# Altium project Service_board.PrjPcb (part 5 of 9)
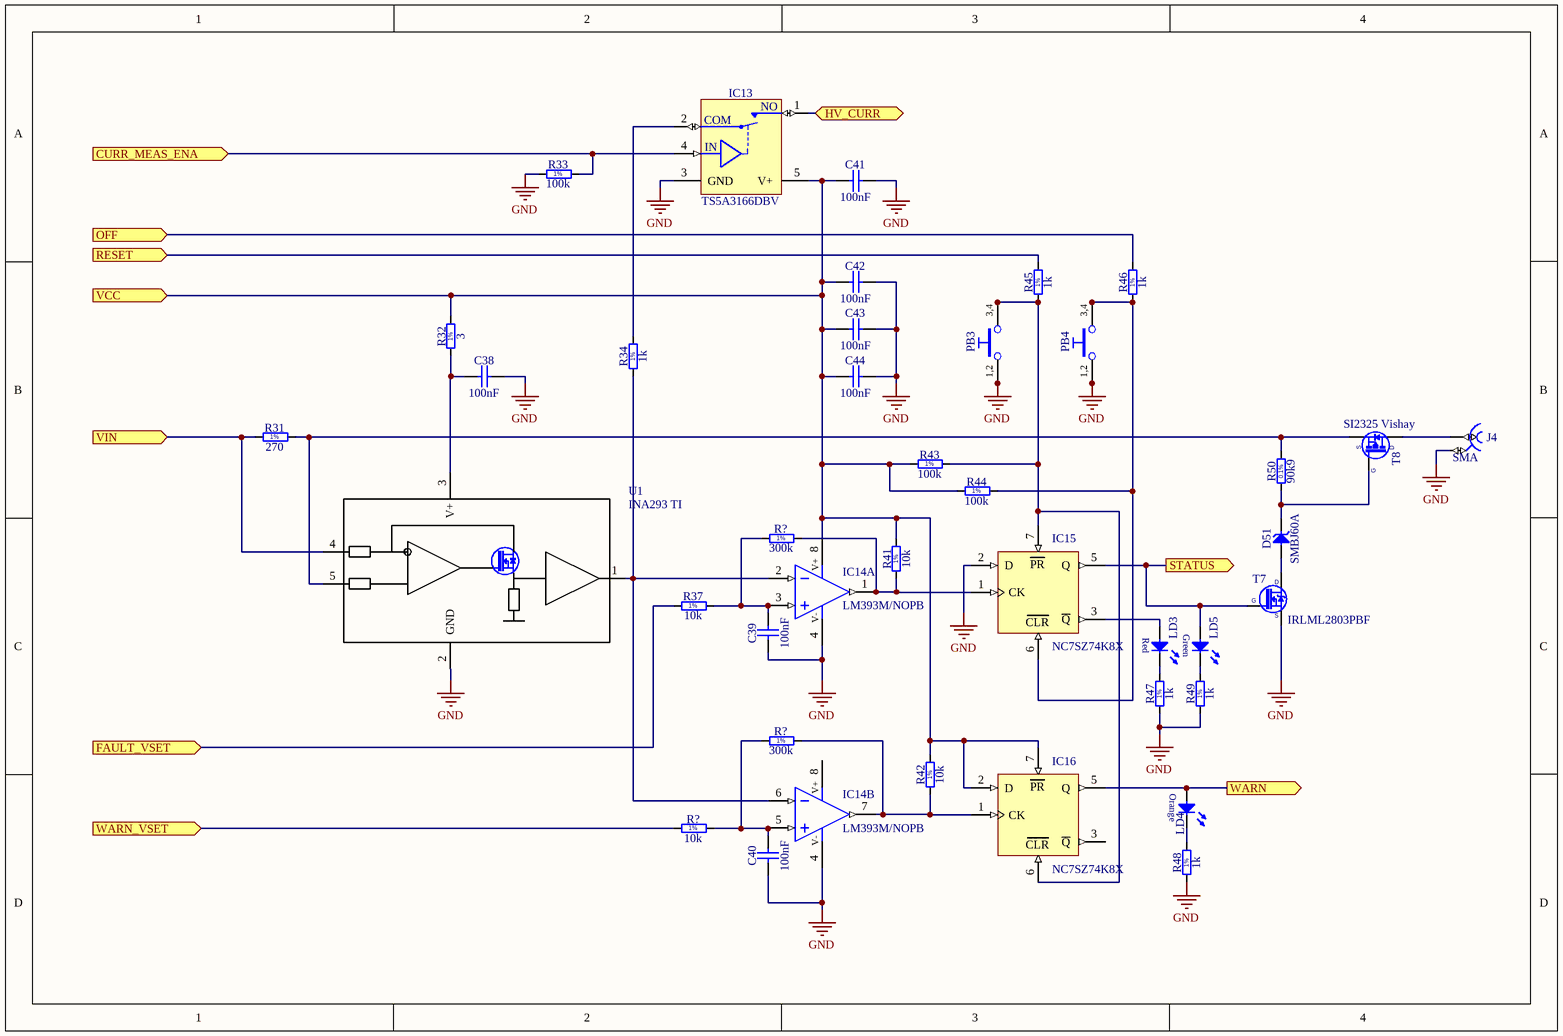
[diagram p11: Switch.SchDoc]

## Sheet Switch.SchDoc (continued)

### Channels (continued)
U_Bank/U_Channel/U_Switch: designators C38=C38_U_Bank_U_Channel_U_Switch#28 C39=C39_U_Bank_U_Channel_U_Switch#28 C40=C40_U_Bank_U_Channel_U_Switch#28 C41=C41_U_Bank_U_Channel_U_Switch#28 C42=C42_U_Bank_U_Channel_U_Switch#28 C43=C43_U_Bank_U_Channel_U_Switch#28 C44=C44_U_Bank_U_Channel_U_Switch#28 D51=D51_U_Bank_U_Channel_U_Switch#28 IC13=IC13_U_Bank_U_Channel_U_Switch#28 IC14=IC14_U_Bank_U_Channel_U_Switch#28 IC15=IC15_U_Bank_U_Channel_U_Switch#28 IC16=IC16_U_Bank_U_Channel_U_Switch#28 J4=J4_U_Bank_U_Channel_U_Switch#28 LD3=LD3_U_Bank_U_Channel_U_Switch#28 LD4=LD4_U_Bank_U_Channel_U_Switch#28 LD5=LD5_U_Bank_U_Channel_U_Switch#28 PB3=PB3_U_Bank_U_Channel_U_Switch#28 PB4=PB4_U_Bank_U_Channel_U_Switch#28 R31=R31_U_Bank_U_Channel_U_Switch#28 R32=R32_U_Bank_U_Channel_U_Switch#28 R33=R33_U_Bank_U_Channel_U_Switch#28 R34=R34_U_Bank_U_Channel_U_Switch#28 R37=R37_U_Bank_U_Channel_U_Switch#28 R41=R41_U_Bank_U_Channel_U_Switch#28 R42=R42_U_Bank_U_Channel_U_Switch#28 R43=R43_U_Bank_U_Channel_U_Switch#28 R44=R44_U_Bank_U_Channel_U_Switch#28 R45=R45_U_Bank_U_Channel_U_Switch#28 R46=R46_U_Bank_U_Channel_U_Switch#28 R47=R47_U_Bank_U_Channel_U_Switch#28 R48=R48_U_Bank_U_Channel_U_Switch#28 R49=R49_U_Bank_U_Channel_U_Switch#28 R50=R50_U_Bank_U_Channel_U_Switch#28 R?=R?_U_Bank_U_Channel_U_Switch#84 R?=R?_U_Bank_U_Channel_U_Switch#83 R?=R?_U_Bank_U_Channel_U_Switch#82 T7=T7_U_Bank_U_Channel_U_Switch#28 T8=T8_U_Bank_U_Channel_U_Switch#28 U1=U1_U_Bank_U_Channel_U_Switch#28; ports CURR_MEAS_ENA=NetIC2_U_Bank_U_Channel#14_7 FAULT_VSET=NetR37_U_Bank_U_Channel_U_Switch#1_1 HV_CURR=NetIC8_23 OFF=NetIC2_U_Bank_U_Channel#14_3 RESET=NetIC2_U_Bank_U_Channel#14_5 STATUS=NetIC2_U_Bank_U_Channel#14_11 VCC=NetC41_U_Bank_U_Channel_U_Switch#1_1 VIN=NetC?#3_2 WARN=W_B1 WARN_VSET=NetR?_U_Bank_U_Channel_U_Switch#3_1
U_Bank/U_Channel/U_Switch: designators C38=C38_U_Bank_U_Channel_U_Switch#29 C39=C39_U_Bank_U_Channel_U_Switch#29 C40=C40_U_Bank_U_Channel_U_Switch#29 C41=C41_U_Bank_U_Channel_U_Switch#29 C42=C42_U_Bank_U_Channel_U_Switch#29 C43=C43_U_Bank_U_Channel_U_Switch#29 C44=C44_U_Bank_U_Channel_U_Switch#29 D51=D51_U_Bank_U_Channel_U_Switch#29 IC13=IC13_U_Bank_U_Channel_U_Switch#29 IC14=IC14_U_Bank_U_Channel_U_Switch#29 IC15=IC15_U_Bank_U_Channel_U_Switch#29 IC16=IC16_U_Bank_U_Channel_U_Switch#29 J4=J4_U_Bank_U_Channel_U_Switch#29 LD3=LD3_U_Bank_U_Channel_U_Switch#29 LD4=LD4_U_Bank_U_Channel_U_Switch#29 LD5=LD5_U_Bank_U_Channel_U_Switch#29 PB3=PB3_U_Bank_U_Channel_U_Switch#29 PB4=PB4_U_Bank_U_Channel_U_Switch#29 R31=R31_U_Bank_U_Channel_U_Switch#29 R32=R32_U_Bank_U_Channel_U_Switch#29 R33=R33_U_Bank_U_Channel_U_Switch#29 R34=R34_U_Bank_U_Channel_U_Switch#29 R37=R37_U_Bank_U_Channel_U_Switch#29 R41=R41_U_Bank_U_Channel_U_Switch#29 R42=R42_U_Bank_U_Channel_U_Switch#29 R43=R43_U_Bank_U_Channel_U_Switch#29 R44=R44_U_Bank_U_Channel_U_Switch#29 R45=R45_U_Bank_U_Channel_U_Switch#29 R46=R46_U_Bank_U_Channel_U_Switch#29 R47=R47_U_Bank_U_Channel_U_Switch#29 R48=R48_U_Bank_U_Channel_U_Switch#29 R49=R49_U_Bank_U_Channel_U_Switch#29 R50=R50_U_Bank_U_Channel_U_Switch#29 R?=R?_U_Bank_U_Channel_U_Switch#87 R?=R?_U_Bank_U_Channel_U_Switch#86 R?=R?_U_Bank_U_Channel_U_Switch#85 T7=T7_U_Bank_U_Channel_U_Switch#29 T8=T8_U_Bank_U_Channel_U_Switch#29 U1=U1_U_Bank_U_Channel_U_Switch#29; ports CURR_MEAS_ENA=NetIC2_U_Bank_U_Channel#15_14 FAULT_VSET=NetR37_U_Bank_U_Channel_U_Switch#1_1 HV_CURR=NetIC8_23 OFF=NetIC2_U_Bank_U_Channel#15_18 RESET=NetIC2_U_Bank_U_Channel#15_16 STATUS=NetIC2_U_Bank_U_Channel#15_8 VCC=NetC41_U_Bank_U_Channel_U_Switch#1_1 VIN=NetC?#3_2 WARN=W_A2 WARN_VSET=NetR?_U_Bank_U_Channel_U_Switch#3_1
U_Bank/U_Channel/U_Switch: designators C38=C38_U_Bank_U_Channel_U_Switch#30 C39=C39_U_Bank_U_Channel_U_Switch#30 C40=C40_U_Bank_U_Channel_U_Switch#30 C41=C41_U_Bank_U_Channel_U_Switch#30 C42=C42_U_Bank_U_Channel_U_Switch#30 C43=C43_U_Bank_U_Channel_U_Switch#30 C44=C44_U_Bank_U_Channel_U_Switch#30 D51=D51_U_Bank_U_Channel_U_Switch#30 IC13=IC13_U_Bank_U_Channel_U_Switch#30 IC14=IC14_U_Bank_U_Channel_U_Switch#30 IC15=IC15_U_Bank_U_Channel_U_Switch#30 IC16=IC16_U_Bank_U_Channel_U_Switch#30 J4=J4_U_Bank_U_Channel_U_Switch#30 LD3=LD3_U_Bank_U_Channel_U_Switch#30 LD4=LD4_U_Bank_U_Channel_U_Switch#30 LD5=LD5_U_Bank_U_Channel_U_Switch#30 PB3=PB3_U_Bank_U_Channel_U_Switch#30 PB4=PB4_U_Bank_U_Channel_U_Switch#30 R31=R31_U_Bank_U_Channel_U_Switch#30 R32=R32_U_Bank_U_Channel_U_Switch#30 R33=R33_U_Bank_U_Channel_U_Switch#30 R34=R34_U_Bank_U_Channel_U_Switch#30 R37=R37_U_Bank_U_Channel_U_Switch#30 R41=R41_U_Bank_U_Channel_U_Switch#30 R42=R42_U_Bank_U_Channel_U_Switch#30 R43=R43_U_Bank_U_Channel_U_Switch#30 R44=R44_U_Bank_U_Channel_U_Switch#30 R45=R45_U_Bank_U_Channel_U_Switch#30 R46=R46_U_Bank_U_Channel_U_Switch#30 R47=R47_U_Bank_U_Channel_U_Switch#30 R48=R48_U_Bank_U_Channel_U_Switch#30 R49=R49_U_Bank_U_Channel_U_Switch#30 R50=R50_U_Bank_U_Channel_U_Switch#30 R?=R?_U_Bank_U_Channel_U_Switch#90 R?=R?_U_Bank_U_Channel_U_Switch#89 R?=R?_U_Bank_U_Channel_U_Switch#88 T7=T7_U_Bank_U_Channel_U_Switch#30 T8=T8_U_Bank_U_Channel_U_Switch#30 U1=U1_U_Bank_U_Channel_U_Switch#30; ports CURR_MEAS_ENA=NetIC2_U_Bank_U_Channel#15_7 FAULT_VSET=NetR37_U_Bank_U_Channel_U_Switch#1_1 HV_CURR=NetIC8_23 OFF=NetIC2_U_Bank_U_Channel#15_3 RESET=NetIC2_U_Bank_U_Channel#15_5 STATUS=NetIC2_U_Bank_U_Channel#15_11 VCC=NetC41_U_Bank_U_Channel_U_Switch#1_1 VIN=NetC?#3_2 WARN=W_B2 WARN_VSET=NetR?_U_Bank_U_Channel_U_Switch#3_1
U_Bank/U_Channel/U_Switch: designators C38=C38_U_Bank_U_Channel_U_Switch#31 C39=C39_U_Bank_U_Channel_U_Switch#31 C40=C40_U_Bank_U_Channel_U_Switch#31 C41=C41_U_Bank_U_Channel_U_Switch#31 C42=C42_U_Bank_U_Channel_U_Switch#31 C43=C43_U_Bank_U_Channel_U_Switch#31 C44=C44_U_Bank_U_Channel_U_Switch#31 D51=D51_U_Bank_U_Channel_U_Switch#31 IC13=IC13_U_Bank_U_Channel_U_Switch#31 IC14=IC14_U_Bank_U_Channel_U_Switch#31 IC15=IC15_U_Bank_U_Channel_U_Switch#31 IC16=IC16_U_Bank_U_Channel_U_Switch#31 J4=J4_U_Bank_U_Channel_U_Switch#31 LD3=LD3_U_Bank_U_Channel_U_Switch#31 LD4=LD4_U_Bank_U_Channel_U_Switch#31 LD5=LD5_U_Bank_U_Channel_U_Switch#31 PB3=PB3_U_Bank_U_Channel_U_Switch#31 PB4=PB4_U_Bank_U_Channel_U_Switch#31 R31=R31_U_Bank_U_Channel_U_Switch#31 R32=R32_U_Bank_U_Channel_U_Switch#31 R33=R33_U_Bank_U_Channel_U_Switch#31 R34=R34_U_Bank_U_Channel_U_Switch#31 R37=R37_U_Bank_U_Channel_U_Switch#31 R41=R41_U_Bank_U_Channel_U_Switch#31 R42=R42_U_Bank_U_Channel_U_Switch#31 R43=R43_U_Bank_U_Channel_U_Switch#31 R44=R44_U_Bank_U_Channel_U_Switch#31 R45=R45_U_Bank_U_Channel_U_Switch#31 R46=R46_U_Bank_U_Channel_U_Switch#31 R47=R47_U_Bank_U_Channel_U_Switch#31 R48=R48_U_Bank_U_Channel_U_Switch#31 R49=R49_U_Bank_U_Channel_U_Switch#31 R50=R50_U_Bank_U_Channel_U_Switch#31 R?=R?_U_Bank_U_Channel_U_Switch#93 R?=R?_U_Bank_U_Channel_U_Switch#92 R?=R?_U_Bank_U_Channel_U_Switch#91 T7=T7_U_Bank_U_Channel_U_Switch#31 T8=T8_U_Bank_U_Channel_U_Switch#31 U1=U1_U_Bank_U_Channel_U_Switch#31; ports CURR_MEAS_ENA=NetIC2_U_Bank_U_Channel#16_14 FAULT_VSET=NetR37_U_Bank_U_Channel_U_Switch#1_1 HV_CURR=NetIC8_23 OFF=NetIC2_U_Bank_U_Channel#16_18 RESET=NetIC2_U_Bank_U_Channel#16_16 STATUS=NetIC2_U_Bank_U_Channel#16_8 VCC=NetC41_U_Bank_U_Channel_U_Switch#1_1 VIN=NetC?#3_2 WARN=W_A3 WARN_VSET=NetR?_U_Bank_U_Channel_U_Switch#3_1
U_Bank/U_Channel/U_Switch: designators C38=C38_U_Bank_U_Channel_U_Switch#32 C39=C39_U_Bank_U_Channel_U_Switch#32 C40=C40_U_Bank_U_Channel_U_Switch#32 C41=C41_U_Bank_U_Channel_U_Switch#32 C42=C42_U_Bank_U_Channel_U_Switch#32 C43=C43_U_Bank_U_Channel_U_Switch#32 C44=C44_U_Bank_U_Channel_U_Switch#32 D51=D51_U_Bank_U_Channel_U_Switch#32 IC13=IC13_U_Bank_U_Channel_U_Switch#32 IC14=IC14_U_Bank_U_Channel_U_Switch#32 IC15=IC15_U_Bank_U_Channel_U_Switch#32 IC16=IC16_U_Bank_U_Channel_U_Switch#32 J4=J4_U_Bank_U_Channel_U_Switch#32 LD3=LD3_U_Bank_U_Channel_U_Switch#32 LD4=LD4_U_Bank_U_Channel_U_Switch#32 LD5=LD5_U_Bank_U_Channel_U_Switch#32 PB3=PB3_U_Bank_U_Channel_U_Switch#32 PB4=PB4_U_Bank_U_Channel_U_Switch#32 R31=R31_U_Bank_U_Channel_U_Switch#32 R32=R32_U_Bank_U_Channel_U_Switch#32 R33=R33_U_Bank_U_Channel_U_Switch#32 R34=R34_U_Bank_U_Channel_U_Switch#32 R37=R37_U_Bank_U_Channel_U_Switch#32 R41=R41_U_Bank_U_Channel_U_Switch#32 R42=R42_U_Bank_U_Channel_U_Switch#32 R43=R43_U_Bank_U_Channel_U_Switch#32 R44=R44_U_Bank_U_Channel_U_Switch#32 R45=R45_U_Bank_U_Channel_U_Switch#32 R46=R46_U_Bank_U_Channel_U_Switch#32 R47=R47_U_Bank_U_Channel_U_Switch#32 R48=R48_U_Bank_U_Channel_U_Switch#32 R49=R49_U_Bank_U_Channel_U_Switch#32 R50=R50_U_Bank_U_Channel_U_Switch#32 R?=R?_U_Bank_U_Channel_U_Switch#96 R?=R?_U_Bank_U_Channel_U_Switch#95 R?=R?_U_Bank_U_Channel_U_Switch#94 T7=T7_U_Bank_U_Channel_U_Switch#32 T8=T8_U_Bank_U_Channel_U_Switch#32 U1=U1_U_Bank_U_Channel_U_Switch#32; ports CURR_MEAS_ENA=NetIC2_U_Bank_U_Channel#16_7 FAULT_VSET=NetR37_U_Bank_U_Channel_U_Switch#1_1 HV_CURR=NetIC8_23 OFF=NetIC2_U_Bank_U_Channel#16_3 RESET=NetIC2_U_Bank_U_Channel#16_5 STATUS=NetIC2_U_Bank_U_Channel#16_11 VCC=NetC41_U_Bank_U_Channel_U_Switch#1_1 VIN=NetC?#3_2 WARN=W_B3 WARN_VSET=NetR?_U_Bank_U_Channel_U_Switch#3_1
U_Bank/U_Channel/U_Switch: designators C38=C38_U_Bank_U_Channel_U_Switch#33 C39=C39_U_Bank_U_Channel_U_Switch#33 C40=C40_U_Bank_U_Channel_U_Switch#33 C41=C41_U_Bank_U_Channel_U_Switch#33 C42=C42_U_Bank_U_Channel_U_Switch#33 C43=C43_U_Bank_U_Channel_U_Switch#33 C44=C44_U_Bank_U_Channel_U_Switch#33 D51=D51_U_Bank_U_Channel_U_Switch#33 IC13=IC13_U_Bank_U_Channel_U_Switch#33 IC14=IC14_U_Bank_U_Channel_U_Switch#33 IC15=IC15_U_Bank_U_Channel_U_Switch#33 IC16=IC16_U_Bank_U_Channel_U_Switch#33 J4=J4_U_Bank_U_Channel_U_Switch#33 LD3=LD3_U_Bank_U_Channel_U_Switch#33 LD4=LD4_U_Bank_U_Channel_U_Switch#33 LD5=LD5_U_Bank_U_Channel_U_Switch#33 PB3=PB3_U_Bank_U_Channel_U_Switch#33 PB4=PB4_U_Bank_U_Channel_U_Switch#33 R31=R31_U_Bank_U_Channel_U_Switch#33 R32=R32_U_Bank_U_Channel_U_Switch#33 R33=R33_U_Bank_U_Channel_U_Switch#33 R34=R34_U_Bank_U_Channel_U_Switch#33 R37=R37_U_Bank_U_Channel_U_Switch#33 R41=R41_U_Bank_U_Channel_U_Switch#33 R42=R42_U_Bank_U_Channel_U_Switch#33 R43=R43_U_Bank_U_Channel_U_Switch#33 R44=R44_U_Bank_U_Channel_U_Switch#33 R45=R45_U_Bank_U_Channel_U_Switch#33 R46=R46_U_Bank_U_Channel_U_Switch#33 R47=R47_U_Bank_U_Channel_U_Switch#33 R48=R48_U_Bank_U_Channel_U_Switch#33 R49=R49_U_Bank_U_Channel_U_Switch#33 R50=R50_U_Bank_U_Channel_U_Switch#33 R?=R?_U_Bank_U_Channel_U_Switch#99 R?=R?_U_Bank_U_Channel_U_Switch#98 R?=R?_U_Bank_U_Channel_U_Switch#97 T7=T7_U_Bank_U_Channel_U_Switch#33 T8=T8_U_Bank_U_Channel_U_Switch#33 U1=U1_U_Bank_U_Channel_U_Switch#33; ports CURR_MEAS_ENA=NetIC2_U_Bank_U_Channel#17_14 FAULT_VSET=NetR37_U_Bank_U_Channel_U_Switch#1_1 HV_CURR=NetIC8_23 OFF=NetIC2_U_Bank_U_Channel#17_18 RESET=NetIC2_U_Bank_U_Channel#17_16 STATUS=NetIC2_U_Bank_U_Channel#17_8 VCC=NetC41_U_Bank_U_Channel_U_Switch#1_1 VIN=NetC?#3_2 WARN=W_A0 WARN_VSET=NetR?_U_Bank_U_Channel_U_Switch#3_1
U_Bank/U_Channel/U_Switch: designators C38=C38_U_Bank_U_Channel_U_Switch#34 C39=C39_U_Bank_U_Channel_U_Switch#34 C40=C40_U_Bank_U_Channel_U_Switch#34 C41=C41_U_Bank_U_Channel_U_Switch#34 C42=C42_U_Bank_U_Channel_U_Switch#34 C43=C43_U_Bank_U_Channel_U_Switch#34 C44=C44_U_Bank_U_Channel_U_Switch#34 D51=D51_U_Bank_U_Channel_U_Switch#34 IC13=IC13_U_Bank_U_Channel_U_Switch#34 IC14=IC14_U_Bank_U_Channel_U_Switch#34 IC15=IC15_U_Bank_U_Channel_U_Switch#34 IC16=IC16_U_Bank_U_Channel_U_Switch#34 J4=J4_U_Bank_U_Channel_U_Switch#34 LD3=LD3_U_Bank_U_Channel_U_Switch#34 LD4=LD4_U_Bank_U_Channel_U_Switch#34 LD5=LD5_U_Bank_U_Channel_U_Switch#34 PB3=PB3_U_Bank_U_Channel_U_Switch#34 PB4=PB4_U_Bank_U_Channel_U_Switch#34 R31=R31_U_Bank_U_Channel_U_Switch#34 R32=R32_U_Bank_U_Channel_U_Switch#34 R33=R33_U_Bank_U_Channel_U_Switch#34 R34=R34_U_Bank_U_Channel_U_Switch#34 R37=R37_U_Bank_U_Channel_U_Switch#34 R41=R41_U_Bank_U_Channel_U_Switch#34 R42=R42_U_Bank_U_Channel_U_Switch#34 R43=R43_U_Bank_U_Channel_U_Switch#34 R44=R44_U_Bank_U_Channel_U_Switch#34 R45=R45_U_Bank_U_Channel_U_Switch#34 R46=R46_U_Bank_U_Channel_U_Switch#34 R47=R47_U_Bank_U_Channel_U_Switch#34 R48=R48_U_Bank_U_Channel_U_Switch#34 R49=R49_U_Bank_U_Channel_U_Switch#34 R50=R50_U_Bank_U_Channel_U_Switch#34 R?=R?_U_Bank_U_Channel_U_Switch#102 R?=R?_U_Bank_U_Channel_U_Switch#101 R?=R?_U_Bank_U_Channel_U_Switch#100 T7=T7_U_Bank_U_Channel_U_Switch#34 T8=T8_U_Bank_U_Channel_U_Switch#34 U1=U1_U_Bank_U_Channel_U_Switch#34; ports CURR_MEAS_ENA=NetIC2_U_Bank_U_Channel#17_7 FAULT_VSET=NetR37_U_Bank_U_Channel_U_Switch#1_1 HV_CURR=NetIC8_23 OFF=NetIC2_U_Bank_U_Channel#17_3 RESET=NetIC2_U_Bank_U_Channel#17_5 STATUS=NetIC2_U_Bank_U_Channel#17_11 VCC=NetC41_U_Bank_U_Channel_U_Switch#1_1 VIN=NetC?#3_2 WARN=W_B0 WARN_VSET=NetR?_U_Bank_U_Channel_U_Switch#3_1
U_Bank/U_Channel/U_Switch: designators C38=C38_U_Bank_U_Channel_U_Switch#35 C39=C39_U_Bank_U_Channel_U_Switch#35 C40=C40_U_Bank_U_Channel_U_Switch#35 C41=C41_U_Bank_U_Channel_U_Switch#35 C42=C42_U_Bank_U_Channel_U_Switch#35 C43=C43_U_Bank_U_Channel_U_Switch#35 C44=C44_U_Bank_U_Channel_U_Switch#35 D51=D51_U_Bank_U_Channel_U_Switch#35 IC13=IC13_U_Bank_U_Channel_U_Switch#35 IC14=IC14_U_Bank_U_Channel_U_Switch#35 IC15=IC15_U_Bank_U_Channel_U_Switch#35 IC16=IC16_U_Bank_U_Channel_U_Switch#35 J4=J4_U_Bank_U_Channel_U_Switch#35 LD3=LD3_U_Bank_U_Channel_U_Switch#35 LD4=LD4_U_Bank_U_Channel_U_Switch#35 LD5=LD5_U_Bank_U_Channel_U_Switch#35 PB3=PB3_U_Bank_U_Channel_U_Switch#35 PB4=PB4_U_Bank_U_Channel_U_Switch#35 R31=R31_U_Bank_U_Channel_U_Switch#35 R32=R32_U_Bank_U_Channel_U_Switch#35 R33=R33_U_Bank_U_Channel_U_Switch#35 R34=R34_U_Bank_U_Channel_U_Switch#35 R37=R37_U_Bank_U_Channel_U_Switch#35 R41=R41_U_Bank_U_Channel_U_Switch#35 R42=R42_U_Bank_U_Channel_U_Switch#35 R43=R43_U_Bank_U_Channel_U_Switch#35 R44=R44_U_Bank_U_Channel_U_Switch#35 R45=R45_U_Bank_U_Channel_U_Switch#35 R46=R46_U_Bank_U_Channel_U_Switch#35 R47=R47_U_Bank_U_Channel_U_Switch#35 R48=R48_U_Bank_U_Channel_U_Switch#35 R49=R49_U_Bank_U_Channel_U_Switch#35 R50=R50_U_Bank_U_Channel_U_Switch#35 R?=R?_U_Bank_U_Channel_U_Switch#105 R?=R?_U_Bank_U_Channel_U_Switch#104 R?=R?_U_Bank_U_Channel_U_Switch#103 T7=T7_U_Bank_U_Channel_U_Switch#35 T8=T8_U_Bank_U_Channel_U_Switch#35 U1=U1_U_Bank_U_Channel_U_Switch#35; ports CURR_MEAS_ENA=NetIC2_U_Bank_U_Channel#18_14 FAULT_VSET=NetR37_U_Bank_U_Channel_U_Switch#1_1 HV_CURR=NetIC8_23 OFF=NetIC2_U_Bank_U_Channel#18_18 RESET=NetIC2_U_Bank_U_Channel#18_16 STATUS=NetIC2_U_Bank_U_Channel#18_8 VCC=NetC41_U_Bank_U_Channel_U_Switch#1_1 VIN=NetC?#3_2 WARN=W_A1 WARN_VSET=NetR?_U_Bank_U_Channel_U_Switch#3_1
U_Bank/U_Channel/U_Switch: designators C38=C38_U_Bank_U_Channel_U_Switch#36 C39=C39_U_Bank_U_Channel_U_Switch#36 C40=C40_U_Bank_U_Channel_U_Switch#36 C41=C41_U_Bank_U_Channel_U_Switch#36 C42=C42_U_Bank_U_Channel_U_Switch#36 C43=C43_U_Bank_U_Channel_U_Switch#36 C44=C44_U_Bank_U_Channel_U_Switch#36 D51=D51_U_Bank_U_Channel_U_Switch#36 IC13=IC13_U_Bank_U_Channel_U_Switch#36 IC14=IC14_U_Bank_U_Channel_U_Switch#36 IC15=IC15_U_Bank_U_Channel_U_Switch#36 IC16=IC16_U_Bank_U_Channel_U_Switch#36 J4=J4_U_Bank_U_Channel_U_Switch#36 LD3=LD3_U_Bank_U_Channel_U_Switch#36 LD4=LD4_U_Bank_U_Channel_U_Switch#36 LD5=LD5_U_Bank_U_Channel_U_Switch#36 PB3=PB3_U_Bank_U_Channel_U_Switch#36 PB4=PB4_U_Bank_U_Channel_U_Switch#36 R31=R31_U_Bank_U_Channel_U_Switch#36 R32=R32_U_Bank_U_Channel_U_Switch#36 R33=R33_U_Bank_U_Channel_U_Switch#36 R34=R34_U_Bank_U_Channel_U_Switch#36 R37=R37_U_Bank_U_Channel_U_Switch#36 R41=R41_U_Bank_U_Channel_U_Switch#36 R42=R42_U_Bank_U_Channel_U_Switch#36 R43=R43_U_Bank_U_Channel_U_Switch#36 R44=R44_U_Bank_U_Channel_U_Switch#36 R45=R45_U_Bank_U_Channel_U_Switch#36 R46=R46_U_Bank_U_Channel_U_Switch#36 R47=R47_U_Bank_U_Channel_U_Switch#36 R48=R48_U_Bank_U_Channel_U_Switch#36 R49=R49_U_Bank_U_Channel_U_Switch#36 R50=R50_U_Bank_U_Channel_U_Switch#36 R?=R?_U_Bank_U_Channel_U_Switch#108 R?=R?_U_Bank_U_Channel_U_Switch#107 R?=R?_U_Bank_U_Channel_U_Switch#106 T7=T7_U_Bank_U_Channel_U_Switch#36 T8=T8_U_Bank_U_Channel_U_Switch#36 U1=U1_U_Bank_U_Channel_U_Switch#36; ports CURR_MEAS_ENA=NetIC2_U_Bank_U_Channel#18_7 FAULT_VSET=NetR37_U_Bank_U_Channel_U_Switch#1_1 HV_CURR=NetIC8_23 OFF=NetIC2_U_Bank_U_Channel#18_3 RESET=NetIC2_U_Bank_U_Channel#18_5 STATUS=NetIC2_U_Bank_U_Channel#18_11 VCC=NetC41_U_Bank_U_Channel_U_Switch#1_1 VIN=NetC?#3_2 WARN=W_B1 WARN_VSET=NetR?_U_Bank_U_Channel_U_Switch#3_1
U_Bank/U_Channel/U_Switch: designators C38=C38_U_Bank_U_Channel_U_Switch#37 C39=C39_U_Bank_U_Channel_U_Switch#37 C40=C40_U_Bank_U_Channel_U_Switch#37 C41=C41_U_Bank_U_Channel_U_Switch#37 C42=C42_U_Bank_U_Channel_U_Switch#37 C43=C43_U_Bank_U_Channel_U_Switch#37 C44=C44_U_Bank_U_Channel_U_Switch#37 D51=D51_U_Bank_U_Channel_U_Switch#37 IC13=IC13_U_Bank_U_Channel_U_Switch#37 IC14=IC14_U_Bank_U_Channel_U_Switch#37 IC15=IC15_U_Bank_U_Channel_U_Switch#37 IC16=IC16_U_Bank_U_Channel_U_Switch#37 J4=J4_U_Bank_U_Channel_U_Switch#37 LD3=LD3_U_Bank_U_Channel_U_Switch#37 LD4=LD4_U_Bank_U_Channel_U_Switch#37 LD5=LD5_U_Bank_U_Channel_U_Switch#37 PB3=PB3_U_Bank_U_Channel_U_Switch#37 PB4=PB4_U_Bank_U_Channel_U_Switch#37 R31=R31_U_Bank_U_Channel_U_Switch#37 R32=R32_U_Bank_U_Channel_U_Switch#37 R33=R33_U_Bank_U_Channel_U_Switch#37 R34=R34_U_Bank_U_Channel_U_Switch#37 R37=R37_U_Bank_U_Channel_U_Switch#37 R41=R41_U_Bank_U_Channel_U_Switch#37 R42=R42_U_Bank_U_Channel_U_Switch#37 R43=R43_U_Bank_U_Channel_U_Switch#37 R44=R44_U_Bank_U_Channel_U_Switch#37 R45=R45_U_Bank_U_Channel_U_Switch#37 R46=R46_U_Bank_U_Channel_U_Switch#37 R47=R47_U_Bank_U_Channel_U_Switch#37 R48=R48_U_Bank_U_Channel_U_Switch#37 R49=R49_U_Bank_U_Channel_U_Switch#37 R50=R50_U_Bank_U_Channel_U_Switch#37 R?=R?_U_Bank_U_Channel_U_Switch#111 R?=R?_U_Bank_U_Channel_U_Switch#110 R?=R?_U_Bank_U_Channel_U_Switch#109 T7=T7_U_Bank_U_Channel_U_Switch#37 T8=T8_U_Bank_U_Channel_U_Switch#37 U1=U1_U_Bank_U_Channel_U_Switch#37; ports CURR_MEAS_ENA=NetIC2_U_Bank_U_Channel#19_14 FAULT_VSET=NetR37_U_Bank_U_Channel_U_Switch#1_1 HV_CURR=NetIC8_23 OFF=NetIC2_U_Bank_U_Channel#19_18 RESET=NetIC2_U_Bank_U_Channel#19_16 STATUS=NetIC2_U_Bank_U_Channel#19_8 VCC=NetC41_U_Bank_U_Channel_U_Switch#1_1 VIN=NetC?#3_2 WARN=W_A2 WARN_VSET=NetR?_U_Bank_U_Channel_U_Switch#3_1
U_Bank/U_Channel/U_Switch: designators C38=C38_U_Bank_U_Channel_U_Switch#38 C39=C39_U_Bank_U_Channel_U_Switch#38 C40=C40_U_Bank_U_Channel_U_Switch#38 C41=C41_U_Bank_U_Channel_U_Switch#38 C42=C42_U_Bank_U_Channel_U_Switch#38 C43=C43_U_Bank_U_Channel_U_Switch#38 C44=C44_U_Bank_U_Channel_U_Switch#38 D51=D51_U_Bank_U_Channel_U_Switch#38 IC13=IC13_U_Bank_U_Channel_U_Switch#38 IC14=IC14_U_Bank_U_Channel_U_Switch#38 IC15=IC15_U_Bank_U_Channel_U_Switch#38 IC16=IC16_U_Bank_U_Channel_U_Switch#38 J4=J4_U_Bank_U_Channel_U_Switch#38 LD3=LD3_U_Bank_U_Channel_U_Switch#38 LD4=LD4_U_Bank_U_Channel_U_Switch#38 LD5=LD5_U_Bank_U_Channel_U_Switch#38 PB3=PB3_U_Bank_U_Channel_U_Switch#38 PB4=PB4_U_Bank_U_Channel_U_Switch#38 R31=R31_U_Bank_U_Channel_U_Switch#38 R32=R32_U_Bank_U_Channel_U_Switch#38 R33=R33_U_Bank_U_Channel_U_Switch#38 R34=R34_U_Bank_U_Channel_U_Switch#38 R37=R37_U_Bank_U_Channel_U_Switch#38 R41=R41_U_Bank_U_Channel_U_Switch#38 R42=R42_U_Bank_U_Channel_U_Switch#38 R43=R43_U_Bank_U_Channel_U_Switch#38 R44=R44_U_Bank_U_Channel_U_Switch#38 R45=R45_U_Bank_U_Channel_U_Switch#38 R46=R46_U_Bank_U_Channel_U_Switch#38 R47=R47_U_Bank_U_Channel_U_Switch#38 R48=R48_U_Bank_U_Channel_U_Switch#38 R49=R49_U_Bank_U_Channel_U_Switch#38 R50=R50_U_Bank_U_Channel_U_Switch#38 R?=R?_U_Bank_U_Channel_U_Switch#114 R?=R?_U_Bank_U_Channel_U_Switch#113 R?=R?_U_Bank_U_Channel_U_Switch#112 T7=T7_U_Bank_U_Channel_U_Switch#38 T8=T8_U_Bank_U_Channel_U_Switch#38 U1=U1_U_Bank_U_Channel_U_Switch#38; ports CURR_MEAS_ENA=NetIC2_U_Bank_U_Channel#19_7 FAULT_VSET=NetR37_U_Bank_U_Channel_U_Switch#1_1 HV_CURR=NetIC8_23 OFF=NetIC2_U_Bank_U_Channel#19_3 RESET=NetIC2_U_Bank_U_Channel#19_5 STATUS=NetIC2_U_Bank_U_Channel#19_11 VCC=NetC41_U_Bank_U_Channel_U_Switch#1_1 VIN=NetC?#3_2 WARN=W_B2 WARN_VSET=NetR?_U_Bank_U_Channel_U_Switch#3_1
U_Bank/U_Channel/U_Switch: designators C38=C38_U_Bank_U_Channel_U_Switch#39 C39=C39_U_Bank_U_Channel_U_Switch#39 C40=C40_U_Bank_U_Channel_U_Switch#39 C41=C41_U_Bank_U_Channel_U_Switch#39 C42=C42_U_Bank_U_Channel_U_Switch#39 C43=C43_U_Bank_U_Channel_U_Switch#39 C44=C44_U_Bank_U_Channel_U_Switch#39 D51=D51_U_Bank_U_Channel_U_Switch#39 IC13=IC13_U_Bank_U_Channel_U_Switch#39 IC14=IC14_U_Bank_U_Channel_U_Switch#39 IC15=IC15_U_Bank_U_Channel_U_Switch#39 IC16=IC16_U_Bank_U_Channel_U_Switch#39 J4=J4_U_Bank_U_Channel_U_Switch#39 LD3=LD3_U_Bank_U_Channel_U_Switch#39 LD4=LD4_U_Bank_U_Channel_U_Switch#39 LD5=LD5_U_Bank_U_Channel_U_Switch#39 PB3=PB3_U_Bank_U_Channel_U_Switch#39 PB4=PB4_U_Bank_U_Channel_U_Switch#39 R31=R31_U_Bank_U_Channel_U_Switch#39 R32=R32_U_Bank_U_Channel_U_Switch#39 R33=R33_U_Bank_U_Channel_U_Switch#39 R34=R34_U_Bank_U_Channel_U_Switch#39 R37=R37_U_Bank_U_Channel_U_Switch#39 R41=R41_U_Bank_U_Channel_U_Switch#39 R42=R42_U_Bank_U_Channel_U_Switch#39 R43=R43_U_Bank_U_Channel_U_Switch#39 R44=R44_U_Bank_U_Channel_U_Switch#39 R45=R45_U_Bank_U_Channel_U_Switch#39 R46=R46_U_Bank_U_Channel_U_Switch#39 R47=R47_U_Bank_U_Channel_U_Switch#39 R48=R48_U_Bank_U_Channel_U_Switch#39 R49=R49_U_Bank_U_Channel_U_Switch#39 R50=R50_U_Bank_U_Channel_U_Switch#39 R?=R?_U_Bank_U_Channel_U_Switch#117 R?=R?_U_Bank_U_Channel_U_Switch#116 R?=R?_U_Bank_U_Channel_U_Switch#115 T7=T7_U_Bank_U_Channel_U_Switch#39 T8=T8_U_Bank_U_Channel_U_Switch#39 U1=U1_U_Bank_U_Channel_U_Switch#39; ports CURR_MEAS_ENA=NetIC2_U_Bank_U_Channel#20_14 FAULT_VSET=NetR37_U_Bank_U_Channel_U_Switch#1_1 HV_CURR=NetIC8_23 OFF=NetIC2_U_Bank_U_Channel#20_18 RESET=NetIC2_U_Bank_U_Channel#20_16 STATUS=NetIC2_U_Bank_U_Channel#20_8 VCC=NetC41_U_Bank_U_Channel_U_Switch#1_1 VIN=NetC?#3_2 WARN=W_A3 WARN_VSET=NetR?_U_Bank_U_Channel_U_Switch#3_1
U_Bank/U_Channel/U_Switch: designators C38=C38_U_Bank_U_Channel_U_Switch#40 C39=C39_U_Bank_U_Channel_U_Switch#40 C40=C40_U_Bank_U_Channel_U_Switch#40 C41=C41_U_Bank_U_Channel_U_Switch#40 C42=C42_U_Bank_U_Channel_U_Switch#40 C43=C43_U_Bank_U_Channel_U_Switch#40 C44=C44_U_Bank_U_Channel_U_Switch#40 D51=D51_U_Bank_U_Channel_U_Switch#40 IC13=IC13_U_Bank_U_Channel_U_Switch#40 IC14=IC14_U_Bank_U_Channel_U_Switch#40 IC15=IC15_U_Bank_U_Channel_U_Switch#40 IC16=IC16_U_Bank_U_Channel_U_Switch#40 J4=J4_U_Bank_U_Channel_U_Switch#40 LD3=LD3_U_Bank_U_Channel_U_Switch#40 LD4=LD4_U_Bank_U_Channel_U_Switch#40 LD5=LD5_U_Bank_U_Channel_U_Switch#40 PB3=PB3_U_Bank_U_Channel_U_Switch#40 PB4=PB4_U_Bank_U_Channel_U_Switch#40 R31=R31_U_Bank_U_Channel_U_Switch#40 R32=R32_U_Bank_U_Channel_U_Switch#40 R33=R33_U_Bank_U_Channel_U_Switch#40 R34=R34_U_Bank_U_Channel_U_Switch#40 R37=R37_U_Bank_U_Channel_U_Switch#40 R41=R41_U_Bank_U_Channel_U_Switch#40 R42=R42_U_Bank_U_Channel_U_Switch#40 R43=R43_U_Bank_U_Channel_U_Switch#40 R44=R44_U_Bank_U_Channel_U_Switch#40 R45=R45_U_Bank_U_Channel_U_Switch#40 R46=R46_U_Bank_U_Channel_U_Switch#40 R47=R47_U_Bank_U_Channel_U_Switch#40 R48=R48_U_Bank_U_Channel_U_Switch#40 R49=R49_U_Bank_U_Channel_U_Switch#40 R50=R50_U_Bank_U_Channel_U_Switch#40 R?=R?_U_Bank_U_Channel_U_Switch#120 R?=R?_U_Bank_U_Channel_U_Switch#119 R?=R?_U_Bank_U_Channel_U_Switch#118 T7=T7_U_Bank_U_Channel_U_Switch#40 T8=T8_U_Bank_U_Channel_U_Switch#40 U1=U1_U_Bank_U_Channel_U_Switch#40; ports CURR_MEAS_ENA=NetIC2_U_Bank_U_Channel#20_7 FAULT_VSET=NetR37_U_Bank_U_Channel_U_Switch#1_1 HV_CURR=NetIC8_23 OFF=NetIC2_U_Bank_U_Channel#20_3 RESET=NetIC2_U_Bank_U_Channel#20_5 STATUS=NetIC2_U_Bank_U_Channel#20_11 VCC=NetC41_U_Bank_U_Channel_U_Switch#1_1 VIN=NetC?#3_2 WARN=W_B3 WARN_VSET=NetR?_U_Bank_U_Channel_U_Switch#3_1
U_Bank/U_Channel/U_Switch: designators C38=C38_U_Bank_U_Channel_U_Switch#41 C39=C39_U_Bank_U_Channel_U_Switch#41 C40=C40_U_Bank_U_Channel_U_Switch#41 C41=C41_U_Bank_U_Channel_U_Switch#41 C42=C42_U_Bank_U_Channel_U_Switch#41 C43=C43_U_Bank_U_Channel_U_Switch#41 C44=C44_U_Bank_U_Channel_U_Switch#41 D51=D51_U_Bank_U_Channel_U_Switch#41 IC13=IC13_U_Bank_U_Channel_U_Switch#41 IC14=IC14_U_Bank_U_Channel_U_Switch#41 IC15=IC15_U_Bank_U_Channel_U_Switch#41 IC16=IC16_U_Bank_U_Channel_U_Switch#41 J4=J4_U_Bank_U_Channel_U_Switch#41 LD3=LD3_U_Bank_U_Channel_U_Switch#41 LD4=LD4_U_Bank_U_Channel_U_Switch#41 LD5=LD5_U_Bank_U_Channel_U_Switch#41 PB3=PB3_U_Bank_U_Channel_U_Switch#41 PB4=PB4_U_Bank_U_Channel_U_Switch#41 R31=R31_U_Bank_U_Channel_U_Switch#41 R32=R32_U_Bank_U_Channel_U_Switch#41 R33=R33_U_Bank_U_Channel_U_Switch#41 R34=R34_U_Bank_U_Channel_U_Switch#41 R37=R37_U_Bank_U_Channel_U_Switch#41 R41=R41_U_Bank_U_Channel_U_Switch#41 R42=R42_U_Bank_U_Channel_U_Switch#41 R43=R43_U_Bank_U_Channel_U_Switch#41 R44=R44_U_Bank_U_Channel_U_Switch#41 R45=R45_U_Bank_U_Channel_U_Switch#41 R46=R46_U_Bank_U_Channel_U_Switch#41 R47=R47_U_Bank_U_Channel_U_Switch#41 R48=R48_U_Bank_U_Channel_U_Switch#41 R49=R49_U_Bank_U_Channel_U_Switch#41 R50=R50_U_Bank_U_Channel_U_Switch#41 R?=R?_U_Bank_U_Channel_U_Switch#123 R?=R?_U_Bank_U_Channel_U_Switch#122 R?=R?_U_Bank_U_Channel_U_Switch#121 T7=T7_U_Bank_U_Channel_U_Switch#41 T8=T8_U_Bank_U_Channel_U_Switch#41 U1=U1_U_Bank_U_Channel_U_Switch#41; ports CURR_MEAS_ENA=NetIC2_U_Bank_U_Channel#21_14 FAULT_VSET=NetR37_U_Bank_U_Channel_U_Switch#1_1 HV_CURR=NetIC8_23 OFF=NetIC2_U_Bank_U_Channel#21_18 RESET=NetIC2_U_Bank_U_Channel#21_16 STATUS=NetIC2_U_Bank_U_Channel#21_8 VCC=NetC41_U_Bank_U_Channel_U_Switch#1_1 VIN=NetC?#3_2 WARN=W_A0 WARN_VSET=NetR?_U_Bank_U_Channel_U_Switch#3_1
U_Bank/U_Channel/U_Switch: designators C38=C38_U_Bank_U_Channel_U_Switch#42 C39=C39_U_Bank_U_Channel_U_Switch#42 C40=C40_U_Bank_U_Channel_U_Switch#42 C41=C41_U_Bank_U_Channel_U_Switch#42 C42=C42_U_Bank_U_Channel_U_Switch#42 C43=C43_U_Bank_U_Channel_U_Switch#42 C44=C44_U_Bank_U_Channel_U_Switch#42 D51=D51_U_Bank_U_Channel_U_Switch#42 IC13=IC13_U_Bank_U_Channel_U_Switch#42 IC14=IC14_U_Bank_U_Channel_U_Switch#42 IC15=IC15_U_Bank_U_Channel_U_Switch#42 IC16=IC16_U_Bank_U_Channel_U_Switch#42 J4=J4_U_Bank_U_Channel_U_Switch#42 LD3=LD3_U_Bank_U_Channel_U_Switch#42 LD4=LD4_U_Bank_U_Channel_U_Switch#42 LD5=LD5_U_Bank_U_Channel_U_Switch#42 PB3=PB3_U_Bank_U_Channel_U_Switch#42 PB4=PB4_U_Bank_U_Channel_U_Switch#42 R31=R31_U_Bank_U_Channel_U_Switch#42 R32=R32_U_Bank_U_Channel_U_Switch#42 R33=R33_U_Bank_U_Channel_U_Switch#42 R34=R34_U_Bank_U_Channel_U_Switch#42 R37=R37_U_Bank_U_Channel_U_Switch#42 R41=R41_U_Bank_U_Channel_U_Switch#42 R42=R42_U_Bank_U_Channel_U_Switch#42 R43=R43_U_Bank_U_Channel_U_Switch#42 R44=R44_U_Bank_U_Channel_U_Switch#42 R45=R45_U_Bank_U_Channel_U_Switch#42 R46=R46_U_Bank_U_Channel_U_Switch#42 R47=R47_U_Bank_U_Channel_U_Switch#42 R48=R48_U_Bank_U_Channel_U_Switch#42 R49=R49_U_Bank_U_Channel_U_Switch#42 R50=R50_U_Bank_U_Channel_U_Switch#42 R?=R?_U_Bank_U_Channel_U_Switch#126 R?=R?_U_Bank_U_Channel_U_Switch#125 R?=R?_U_Bank_U_Channel_U_Switch#124 T7=T7_U_Bank_U_Channel_U_Switch#42 T8=T8_U_Bank_U_Channel_U_Switch#42 U1=U1_U_Bank_U_Channel_U_Switch#42; ports CURR_MEAS_ENA=NetIC2_U_Bank_U_Channel#21_7 FAULT_VSET=NetR37_U_Bank_U_Channel_U_Switch#1_1 HV_CURR=NetIC8_23 OFF=NetIC2_U_Bank_U_Channel#21_3 RESET=NetIC2_U_Bank_U_Channel#21_5 STATUS=NetIC2_U_Bank_U_Channel#21_11 VCC=NetC41_U_Bank_U_Channel_U_Switch#1_1 VIN=NetC?#3_2 WARN=W_B0 WARN_VSET=NetR?_U_Bank_U_Channel_U_Switch#3_1
U_Bank/U_Channel/U_Switch: designators C38=C38_U_Bank_U_Channel_U_Switch#43 C39=C39_U_Bank_U_Channel_U_Switch#43 C40=C40_U_Bank_U_Channel_U_Switch#43 C41=C41_U_Bank_U_Channel_U_Switch#43 C42=C42_U_Bank_U_Channel_U_Switch#43 C43=C43_U_Bank_U_Channel_U_Switch#43 C44=C44_U_Bank_U_Channel_U_Switch#43 D51=D51_U_Bank_U_Channel_U_Switch#43 IC13=IC13_U_Bank_U_Channel_U_Switch#43 IC14=IC14_U_Bank_U_Channel_U_Switch#43 IC15=IC15_U_Bank_U_Channel_U_Switch#43 IC16=IC16_U_Bank_U_Channel_U_Switch#43 J4=J4_U_Bank_U_Channel_U_Switch#43 LD3=LD3_U_Bank_U_Channel_U_Switch#43 LD4=LD4_U_Bank_U_Channel_U_Switch#43 LD5=LD5_U_Bank_U_Channel_U_Switch#43 PB3=PB3_U_Bank_U_Channel_U_Switch#43 PB4=PB4_U_Bank_U_Channel_U_Switch#43 R31=R31_U_Bank_U_Channel_U_Switch#43 R32=R32_U_Bank_U_Channel_U_Switch#43 R33=R33_U_Bank_U_Channel_U_Switch#43 R34=R34_U_Bank_U_Channel_U_Switch#43 R37=R37_U_Bank_U_Channel_U_Switch#43 R41=R41_U_Bank_U_Channel_U_Switch#43 R42=R42_U_Bank_U_Channel_U_Switch#43 R43=R43_U_Bank_U_Channel_U_Switch#43 R44=R44_U_Bank_U_Channel_U_Switch#43 R45=R45_U_Bank_U_Channel_U_Switch#43 R46=R46_U_Bank_U_Channel_U_Switch#43 R47=R47_U_Bank_U_Channel_U_Switch#43 R48=R48_U_Bank_U_Channel_U_Switch#43 R49=R49_U_Bank_U_Channel_U_Switch#43 R50=R50_U_Bank_U_Channel_U_Switch#43 R?=R?_U_Bank_U_Channel_U_Switch#129 R?=R?_U_Bank_U_Channel_U_Switch#128 R?=R?_U_Bank_U_Channel_U_Switch#127 T7=T7_U_Bank_U_Channel_U_Switch#43 T8=T8_U_Bank_U_Channel_U_Switch#43 U1=U1_U_Bank_U_Channel_U_Switch#43; ports CURR_MEAS_ENA=NetIC2_U_Bank_U_Channel#22_14 FAULT_VSET=NetR37_U_Bank_U_Channel_U_Switch#1_1 HV_CURR=NetIC8_23 OFF=NetIC2_U_Bank_U_Channel#22_18 RESET=NetIC2_U_Bank_U_Channel#22_16 STATUS=NetIC2_U_Bank_U_Channel#22_8 VCC=NetC41_U_Bank_U_Channel_U_Switch#1_1 VIN=NetC?#3_2 WARN=W_A1 WARN_VSET=NetR?_U_Bank_U_Channel_U_Switch#3_1
U_Bank/U_Channel/U_Switch: designators C38=C38_U_Bank_U_Channel_U_Switch#44 C39=C39_U_Bank_U_Channel_U_Switch#44 C40=C40_U_Bank_U_Channel_U_Switch#44 C41=C41_U_Bank_U_Channel_U_Switch#44 C42=C42_U_Bank_U_Channel_U_Switch#44 C43=C43_U_Bank_U_Channel_U_Switch#44 C44=C44_U_Bank_U_Channel_U_Switch#44 D51=D51_U_Bank_U_Channel_U_Switch#44 IC13=IC13_U_Bank_U_Channel_U_Switch#44 IC14=IC14_U_Bank_U_Channel_U_Switch#44 IC15=IC15_U_Bank_U_Channel_U_Switch#44 IC16=IC16_U_Bank_U_Channel_U_Switch#44 J4=J4_U_Bank_U_Channel_U_Switch#44 LD3=LD3_U_Bank_U_Channel_U_Switch#44 LD4=LD4_U_Bank_U_Channel_U_Switch#44 LD5=LD5_U_Bank_U_Channel_U_Switch#44 PB3=PB3_U_Bank_U_Channel_U_Switch#44 PB4=PB4_U_Bank_U_Channel_U_Switch#44 R31=R31_U_Bank_U_Channel_U_Switch#44 R32=R32_U_Bank_U_Channel_U_Switch#44 R33=R33_U_Bank_U_Channel_U_Switch#44 R34=R34_U_Bank_U_Channel_U_Switch#44 R37=R37_U_Bank_U_Channel_U_Switch#44 R41=R41_U_Bank_U_Channel_U_Switch#44 R42=R42_U_Bank_U_Channel_U_Switch#44 R43=R43_U_Bank_U_Channel_U_Switch#44 R44=R44_U_Bank_U_Channel_U_Switch#44 R45=R45_U_Bank_U_Channel_U_Switch#44 R46=R46_U_Bank_U_Channel_U_Switch#44 R47=R47_U_Bank_U_Channel_U_Switch#44 R48=R48_U_Bank_U_Channel_U_Switch#44 R49=R49_U_Bank_U_Channel_U_Switch#44 R50=R50_U_Bank_U_Channel_U_Switch#44 R?=R?_U_Bank_U_Channel_U_Switch#132 R?=R?_U_Bank_U_Channel_U_Switch#131 R?=R?_U_Bank_U_Channel_U_Switch#130 T7=T7_U_Bank_U_Channel_U_Switch#44 T8=T8_U_Bank_U_Channel_U_Switch#44 U1=U1_U_Bank_U_Channel_U_Switch#44; ports CURR_MEAS_ENA=NetIC2_U_Bank_U_Channel#22_7 FAULT_VSET=NetR37_U_Bank_U_Channel_U_Switch#1_1 HV_CURR=NetIC8_23 OFF=NetIC2_U_Bank_U_Channel#22_3 RESET=NetIC2_U_Bank_U_Channel#22_5 STATUS=NetIC2_U_Bank_U_Channel#22_11 VCC=NetC41_U_Bank_U_Channel_U_Switch#1_1 VIN=NetC?#3_2 WARN=W_B1 WARN_VSET=NetR?_U_Bank_U_Channel_U_Switch#3_1
U_Bank/U_Channel/U_Switch: designators C38=C38_U_Bank_U_Channel_U_Switch#45 C39=C39_U_Bank_U_Channel_U_Switch#45 C40=C40_U_Bank_U_Channel_U_Switch#45 C41=C41_U_Bank_U_Channel_U_Switch#45 C42=C42_U_Bank_U_Channel_U_Switch#45 C43=C43_U_Bank_U_Channel_U_Switch#45 C44=C44_U_Bank_U_Channel_U_Switch#45 D51=D51_U_Bank_U_Channel_U_Switch#45 IC13=IC13_U_Bank_U_Channel_U_Switch#45 IC14=IC14_U_Bank_U_Channel_U_Switch#45 IC15=IC15_U_Bank_U_Channel_U_Switch#45 IC16=IC16_U_Bank_U_Channel_U_Switch#45 J4=J4_U_Bank_U_Channel_U_Switch#45 LD3=LD3_U_Bank_U_Channel_U_Switch#45 LD4=LD4_U_Bank_U_Channel_U_Switch#45 LD5=LD5_U_Bank_U_Channel_U_Switch#45 PB3=PB3_U_Bank_U_Channel_U_Switch#45 PB4=PB4_U_Bank_U_Channel_U_Switch#45 R31=R31_U_Bank_U_Channel_U_Switch#45 R32=R32_U_Bank_U_Channel_U_Switch#45 R33=R33_U_Bank_U_Channel_U_Switch#45 R34=R34_U_Bank_U_Channel_U_Switch#45 R37=R37_U_Bank_U_Channel_U_Switch#45 R41=R41_U_Bank_U_Channel_U_Switch#45 R42=R42_U_Bank_U_Channel_U_Switch#45 R43=R43_U_Bank_U_Channel_U_Switch#45 R44=R44_U_Bank_U_Channel_U_Switch#45 R45=R45_U_Bank_U_Channel_U_Switch#45 R46=R46_U_Bank_U_Channel_U_Switch#45 R47=R47_U_Bank_U_Channel_U_Switch#45 R48=R48_U_Bank_U_Channel_U_Switch#45 R49=R49_U_Bank_U_Channel_U_Switch#45 R50=R50_U_Bank_U_Channel_U_Switch#45 R?=R?_U_Bank_U_Channel_U_Switch#135 R?=R?_U_Bank_U_Channel_U_Switch#134 R?=R?_U_Bank_U_Channel_U_Switch#133 T7=T7_U_Bank_U_Channel_U_Switch#45 T8=T8_U_Bank_U_Channel_U_Switch#45 U1=U1_U_Bank_U_Channel_U_Switch#45; ports CURR_MEAS_ENA=NetIC2_U_Bank_U_Channel#23_14 FAULT_VSET=NetR37_U_Bank_U_Channel_U_Switch#1_1 HV_CURR=NetIC8_23 OFF=NetIC2_U_Bank_U_Channel#23_18 RESET=NetIC2_U_Bank_U_Channel#23_16 STATUS=NetIC2_U_Bank_U_Channel#23_8 VCC=NetC41_U_Bank_U_Channel_U_Switch#1_1 VIN=NetC?#3_2 WARN=W_A2 WARN_VSET=NetR?_U_Bank_U_Channel_U_Switch#3_1
U_Bank/U_Channel/U_Switch: designators C38=C38_U_Bank_U_Channel_U_Switch#46 C39=C39_U_Bank_U_Channel_U_Switch#46 C40=C40_U_Bank_U_Channel_U_Switch#46 C41=C41_U_Bank_U_Channel_U_Switch#46 C42=C42_U_Bank_U_Channel_U_Switch#46 C43=C43_U_Bank_U_Channel_U_Switch#46 C44=C44_U_Bank_U_Channel_U_Switch#46 D51=D51_U_Bank_U_Channel_U_Switch#46 IC13=IC13_U_Bank_U_Channel_U_Switch#46 IC14=IC14_U_Bank_U_Channel_U_Switch#46 IC15=IC15_U_Bank_U_Channel_U_Switch#46 IC16=IC16_U_Bank_U_Channel_U_Switch#46 J4=J4_U_Bank_U_Channel_U_Switch#46 LD3=LD3_U_Bank_U_Channel_U_Switch#46 LD4=LD4_U_Bank_U_Channel_U_Switch#46 LD5=LD5_U_Bank_U_Channel_U_Switch#46 PB3=PB3_U_Bank_U_Channel_U_Switch#46 PB4=PB4_U_Bank_U_Channel_U_Switch#46 R31=R31_U_Bank_U_Channel_U_Switch#46 R32=R32_U_Bank_U_Channel_U_Switch#46 R33=R33_U_Bank_U_Channel_U_Switch#46 R34=R34_U_Bank_U_Channel_U_Switch#46 R37=R37_U_Bank_U_Channel_U_Switch#46 R41=R41_U_Bank_U_Channel_U_Switch#46 R42=R42_U_Bank_U_Channel_U_Switch#46 R43=R43_U_Bank_U_Channel_U_Switch#46 R44=R44_U_Bank_U_Channel_U_Switch#46 R45=R45_U_Bank_U_Channel_U_Switch#46 R46=R46_U_Bank_U_Channel_U_Switch#46 R47=R47_U_Bank_U_Channel_U_Switch#46 R48=R48_U_Bank_U_Channel_U_Switch#46 R49=R49_U_Bank_U_Channel_U_Switch#46 R50=R50_U_Bank_U_Channel_U_Switch#46 R?=R?_U_Bank_U_Channel_U_Switch#138 R?=R?_U_Bank_U_Channel_U_Switch#137 R?=R?_U_Bank_U_Channel_U_Switch#136 T7=T7_U_Bank_U_Channel_U_Switch#46 T8=T8_U_Bank_U_Channel_U_Switch#46 U1=U1_U_Bank_U_Channel_U_Switch#46; ports CURR_MEAS_ENA=NetIC2_U_Bank_U_Channel#23_7 FAULT_VSET=NetR37_U_Bank_U_Channel_U_Switch#1_1 HV_CURR=NetIC8_23 OFF=NetIC2_U_Bank_U_Channel#23_3 RESET=NetIC2_U_Bank_U_Channel#23_5 STATUS=NetIC2_U_Bank_U_Channel#23_11 VCC=NetC41_U_Bank_U_Channel_U_Switch#1_1 VIN=NetC?#3_2 WARN=W_B2 WARN_VSET=NetR?_U_Bank_U_Channel_U_Switch#3_1
U_Bank/U_Channel/U_Switch: designators C38=C38_U_Bank_U_Channel_U_Switch#47 C39=C39_U_Bank_U_Channel_U_Switch#47 C40=C40_U_Bank_U_Channel_U_Switch#47 C41=C41_U_Bank_U_Channel_U_Switch#47 C42=C42_U_Bank_U_Channel_U_Switch#47 C43=C43_U_Bank_U_Channel_U_Switch#47 C44=C44_U_Bank_U_Channel_U_Switch#47 D51=D51_U_Bank_U_Channel_U_Switch#47 IC13=IC13_U_Bank_U_Channel_U_Switch#47 IC14=IC14_U_Bank_U_Channel_U_Switch#47 IC15=IC15_U_Bank_U_Channel_U_Switch#47 IC16=IC16_U_Bank_U_Channel_U_Switch#47 J4=J4_U_Bank_U_Channel_U_Switch#47 LD3=LD3_U_Bank_U_Channel_U_Switch#47 LD4=LD4_U_Bank_U_Channel_U_Switch#47 LD5=LD5_U_Bank_U_Channel_U_Switch#47 PB3=PB3_U_Bank_U_Channel_U_Switch#47 PB4=PB4_U_Bank_U_Channel_U_Switch#47 R31=R31_U_Bank_U_Channel_U_Switch#47 R32=R32_U_Bank_U_Channel_U_Switch#47 R33=R33_U_Bank_U_Channel_U_Switch#47 R34=R34_U_Bank_U_Channel_U_Switch#47 R37=R37_U_Bank_U_Channel_U_Switch#47 R41=R41_U_Bank_U_Channel_U_Switch#47 R42=R42_U_Bank_U_Channel_U_Switch#47 R43=R43_U_Bank_U_Channel_U_Switch#47 R44=R44_U_Bank_U_Channel_U_Switch#47 R45=R45_U_Bank_U_Channel_U_Switch#47 R46=R46_U_Bank_U_Channel_U_Switch#47 R47=R47_U_Bank_U_Channel_U_Switch#47 R48=R48_U_Bank_U_Channel_U_Switch#47 R49=R49_U_Bank_U_Channel_U_Switch#47 R50=R50_U_Bank_U_Channel_U_Switch#47 R?=R?_U_Bank_U_Channel_U_Switch#141 R?=R?_U_Bank_U_Channel_U_Switch#140 R?=R?_U_Bank_U_Channel_U_Switch#139 T7=T7_U_Bank_U_Channel_U_Switch#47 T8=T8_U_Bank_U_Channel_U_Switch#47 U1=U1_U_Bank_U_Channel_U_Switch#47; ports CURR_MEAS_ENA=NetIC2_U_Bank_U_Channel#24_14 FAULT_VSET=NetR37_U_Bank_U_Channel_U_Switch#1_1 HV_CURR=NetIC8_23 OFF=NetIC2_U_Bank_U_Channel#24_18 RESET=NetIC2_U_Bank_U_Channel#24_16 STATUS=NetIC2_U_Bank_U_Channel#24_8 VCC=NetC41_U_Bank_U_Channel_U_Switch#1_1 VIN=NetC?#3_2 WARN=W_A3 WARN_VSET=NetR?_U_Bank_U_Channel_U_Switch#3_1
U_Bank/U_Channel/U_Switch: designators C38=C38_U_Bank_U_Channel_U_Switch#48 C39=C39_U_Bank_U_Channel_U_Switch#48 C40=C40_U_Bank_U_Channel_U_Switch#48 C41=C41_U_Bank_U_Channel_U_Switch#48 C42=C42_U_Bank_U_Channel_U_Switch#48 C43=C43_U_Bank_U_Channel_U_Switch#48 C44=C44_U_Bank_U_Channel_U_Switch#48 D51=D51_U_Bank_U_Channel_U_Switch#48 IC13=IC13_U_Bank_U_Channel_U_Switch#48 IC14=IC14_U_Bank_U_Channel_U_Switch#48 IC15=IC15_U_Bank_U_Channel_U_Switch#48 IC16=IC16_U_Bank_U_Channel_U_Switch#48 J4=J4_U_Bank_U_Channel_U_Switch#48 LD3=LD3_U_Bank_U_Channel_U_Switch#48 LD4=LD4_U_Bank_U_Channel_U_Switch#48 LD5=LD5_U_Bank_U_Channel_U_Switch#48 PB3=PB3_U_Bank_U_Channel_U_Switch#48 PB4=PB4_U_Bank_U_Channel_U_Switch#48 R31=R31_U_Bank_U_Channel_U_Switch#48 R32=R32_U_Bank_U_Channel_U_Switch#48 R33=R33_U_Bank_U_Channel_U_Switch#48 R34=R34_U_Bank_U_Channel_U_Switch#48 R37=R37_U_Bank_U_Channel_U_Switch#48 R41=R41_U_Bank_U_Channel_U_Switch#48 R42=R42_U_Bank_U_Channel_U_Switch#48 R43=R43_U_Bank_U_Channel_U_Switch#48 R44=R44_U_Bank_U_Channel_U_Switch#48 R45=R45_U_Bank_U_Channel_U_Switch#48 R46=R46_U_Bank_U_Channel_U_Switch#48 R47=R47_U_Bank_U_Channel_U_Switch#48 R48=R48_U_Bank_U_Channel_U_Switch#48 R49=R49_U_Bank_U_Channel_U_Switch#48 R50=R50_U_Bank_U_Channel_U_Switch#48 R?=R?_U_Bank_U_Channel_U_Switch#144 R?=R?_U_Bank_U_Channel_U_Switch#143 R?=R?_U_Bank_U_Channel_U_Switch#142 T7=T7_U_Bank_U_Channel_U_Switch#48 T8=T8_U_Bank_U_Channel_U_Switch#48 U1=U1_U_Bank_U_Channel_U_Switch#48; ports CURR_MEAS_ENA=NetIC2_U_Bank_U_Channel#24_7 FAULT_VSET=NetR37_U_Bank_U_Channel_U_Switch#1_1 HV_CURR=NetIC8_23 OFF=NetIC2_U_Bank_U_Channel#24_3 RESET=NetIC2_U_Bank_U_Channel#24_5 STATUS=NetIC2_U_Bank_U_Channel#24_11 VCC=NetC41_U_Bank_U_Channel_U_Switch#1_1 VIN=NetC?#3_2 WARN=W_B3 WARN_VSET=NetR?_U_Bank_U_Channel_U_Switch#3_1